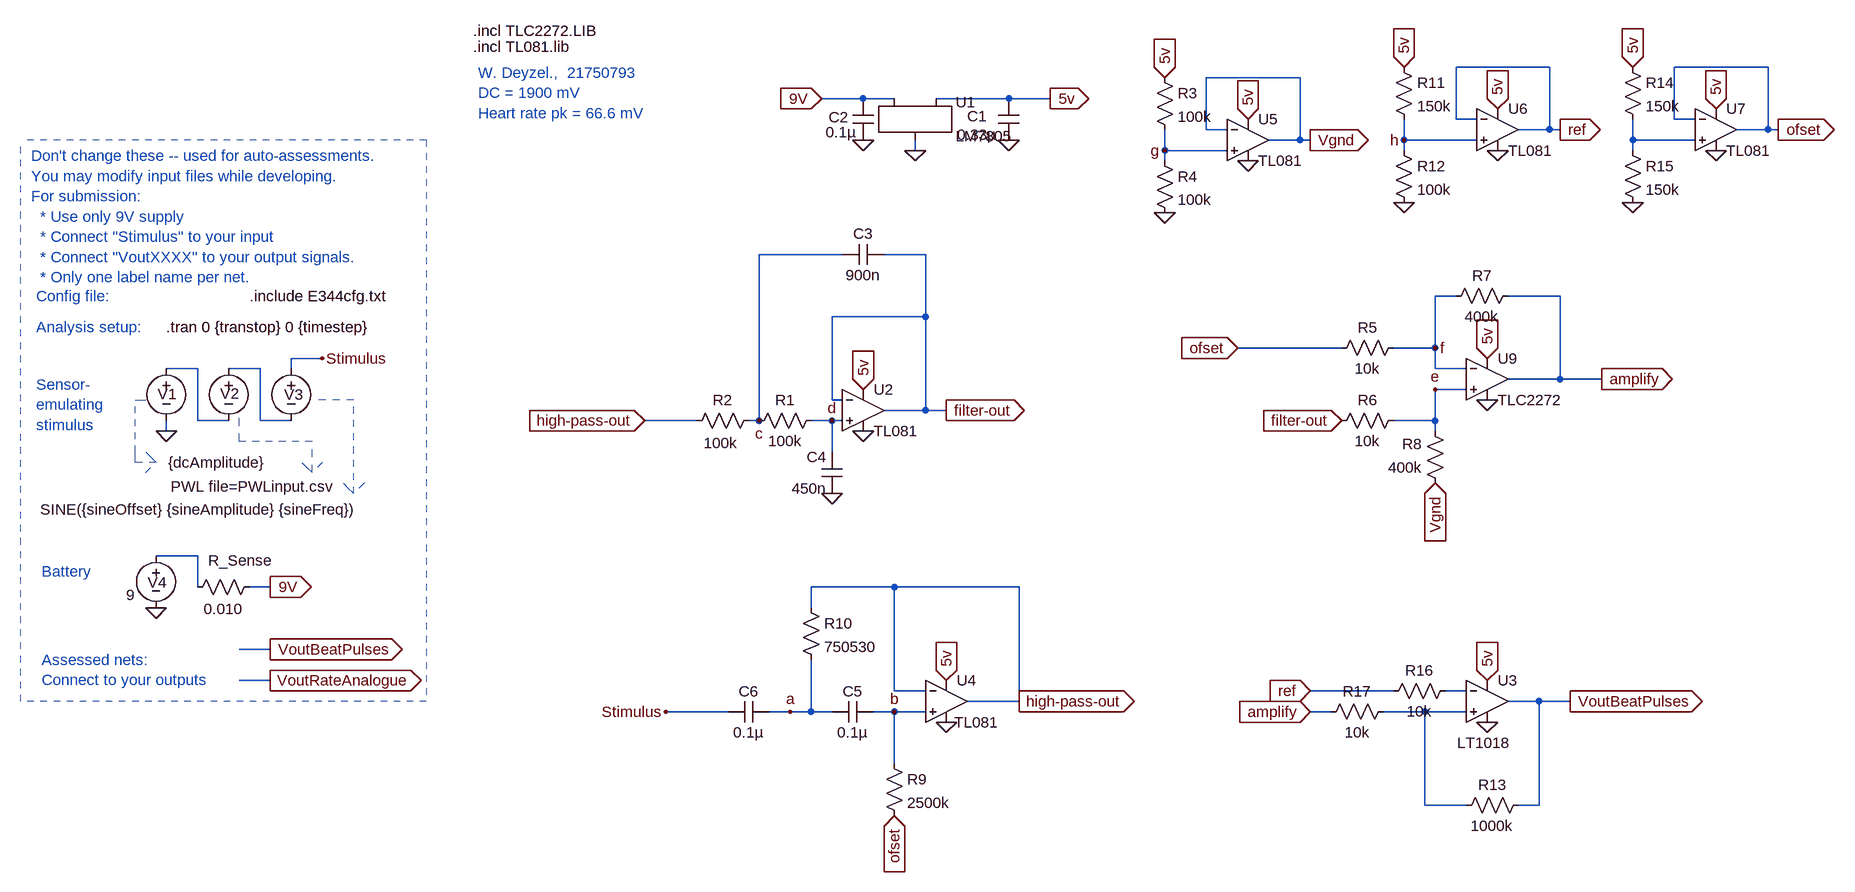
[diagram p0: schematic www.asc]
www.asc, the LTspice schematic file:
Version 4
SHEET 1 1824 680
WIRE 48 -1520 -96 -1520
WIRE 384 -1520 240 -1520
WIRE -336 -1504 -480 -1504
WIRE -1008 -1472 -1072 -1472
WIRE -960 -1472 -1008 -1472
WIRE -784 -1472 -896 -1472
WIRE -720 -1472 -784 -1472
WIRE -96 -1440 -96 -1520
WIRE -64 -1440 -96 -1440
WIRE 240 -1440 240 -1520
WIRE 272 -1440 240 -1440
WIRE -480 -1424 -480 -1504
WIRE -448 -1424 -480 -1424
WIRE 48 -1424 48 -1520
WIRE 48 -1424 0 -1424
WIRE 64 -1424 48 -1424
WIRE 384 -1424 384 -1520
WIRE 384 -1424 336 -1424
WIRE 400 -1424 384 -1424
WIRE -336 -1408 -336 -1504
WIRE -336 -1408 -384 -1408
WIRE -320 -1408 -336 -1408
WIRE -176 -1408 -176 -1440
WIRE -64 -1408 -176 -1408
WIRE 176 -1408 176 -1440
WIRE 272 -1408 176 -1408
WIRE -928 -1392 -928 -1408
WIRE -544 -1392 -544 -1424
WIRE -448 -1392 -544 -1392
WIRE -176 -1392 -176 -1408
WIRE 176 -1392 176 -1408
WIRE -544 -1376 -544 -1392
WIRE -1040 -1232 -1168 -1232
WIRE -912 -1232 -976 -1232
WIRE -96 -1168 -128 -1168
WIRE 64 -1168 -16 -1168
WIRE -912 -1136 -912 -1232
WIRE -912 -1136 -1056 -1136
WIRE -272 -1088 -432 -1088
WIRE -128 -1088 -128 -1168
WIRE -128 -1088 -192 -1088
WIRE -1840 -1072 -1888 -1072
WIRE -2032 -1056 -2080 -1056
WIRE -1936 -1056 -1984 -1056
WIRE -1888 -1056 -1888 -1072
WIRE -128 -1056 -128 -1088
WIRE -80 -1056 -128 -1056
WIRE 64 -1040 64 -1168
WIRE 64 -1040 -16 -1040
WIRE 128 -1040 64 -1040
WIRE -80 -1024 -128 -1024
WIRE -1056 -1008 -1056 -1136
WIRE -1040 -1008 -1056 -1008
WIRE -912 -992 -912 -1136
WIRE -912 -992 -976 -992
WIRE -880 -992 -912 -992
WIRE -2032 -976 -2032 -1056
WIRE -1984 -976 -2032 -976
WIRE -1936 -976 -1936 -1056
WIRE -1888 -976 -1936 -976
WIRE -1264 -976 -1344 -976
WIRE -1168 -976 -1168 -1232
WIRE -1168 -976 -1184 -976
WIRE -1056 -976 -1088 -976
WIRE -1040 -976 -1056 -976
WIRE -128 -976 -128 -1024
WIRE -128 -976 -192 -976
WIRE -2080 -960 -2080 -976
WIRE -128 -960 -128 -976
WIRE -1056 -928 -1056 -976
WIRE -2032 -768 -2096 -768
WIRE -2032 -720 -2032 -768
WIRE -1920 -720 -1952 -720
WIRE -960 -720 -1088 -720
WIRE -768 -720 -960 -720
WIRE -1088 -688 -1088 -720
WIRE -1920 -624 -1968 -624
WIRE -1920 -576 -1968 -576
WIRE -960 -560 -960 -720
WIRE -912 -560 -960 -560
WIRE -192 -560 -320 -560
WIRE -80 -560 -112 -560
WIRE -768 -544 -768 -720
WIRE -768 -544 -848 -544
WIRE 32 -544 -16 -544
WIRE 80 -544 32 -544
WIRE -1216 -528 -1312 -528
WIRE -1120 -528 -1152 -528
WIRE -1088 -528 -1088 -608
WIRE -1088 -528 -1120 -528
WIRE -1056 -528 -1088 -528
WIRE -960 -528 -992 -528
WIRE -912 -528 -960 -528
WIRE -288 -528 -320 -528
WIRE -144 -528 -208 -528
WIRE -80 -528 -144 -528
WIRE -960 -448 -960 -528
WIRE -144 -384 -144 -528
WIRE -80 -384 -144 -384
WIRE 32 -384 32 -544
WIRE 32 -384 0 -384
FLAG -2080 -960 0
FLAG -1840 -1072 Stimulus
FLAG -1920 -720 9V
IOPIN -1920 -720 Out
FLAG -2096 -688 0
FLAG -1920 -624 VoutBeatPulses
IOPIN -1920 -624 Out
FLAG -1920 -576 VoutRateAnalogue
IOPIN -1920 -576 Out
FLAG -1312 -528 Stimulus
FLAG -928 -1392 0
FLAG -1072 -1472 9V
IOPIN -1072 -1472 In
FLAG -1008 -1408 0
FLAG -784 -1408 0
FLAG -720 -1472 5v
IOPIN -720 -1472 Out
FLAG -1008 -960 0
FLAG -1008 -1024 5v
IOPIN -1008 -1024 In
FLAG -1056 -864 0
FLAG -544 -1504 5v
IOPIN -544 -1504 In
FLAG -544 -1296 0
FLAG -320 -1408 Vgnd
IOPIN -320 -1408 Out
FLAG -272 -976 filter-out
IOPIN -272 -976 In
FLAG -48 -1008 0
FLAG -48 -1072 5v
IOPIN -48 -1072 In
FLAG -128 -880 Vgnd
IOPIN -128 -880 In
FLAG -880 -992 filter-out
IOPIN -880 -992 Out
FLAG -880 -576 5v
IOPIN -880 -576 In
FLAG -880 -512 0
FLAG -768 -544 high-pass-out
IOPIN -768 -544 Out
FLAG -1344 -976 high-pass-out
IOPIN -1344 -976 In
FLAG -960 -368 ofset
IOPIN -960 -368 In
FLAG -432 -1088 ofset
IOPIN -432 -1088 In
FLAG 128 -1040 amplify
IOPIN 128 -1040 Out
FLAG -416 -1376 0
FLAG -416 -1440 5v
IOPIN -416 -1440 In
FLAG -176 -1520 5v
IOPIN -176 -1520 In
FLAG -176 -1312 0
FLAG 64 -1424 ref
IOPIN 64 -1424 Out
FLAG -32 -1392 0
FLAG -32 -1456 5v
IOPIN -32 -1456 In
FLAG -1120 -528 a
FLAG -960 -528 b
FLAG -1168 -976 c
FLAG -1056 -976 d
FLAG -128 -1024 e
FLAG -128 -1088 f
FLAG -544 -1392 g
FLAG -176 -1408 h
FLAG 176 -1520 5v
IOPIN 176 -1520 In
FLAG 176 -1312 0
FLAG 400 -1424 ofset
IOPIN 400 -1424 Out
FLAG 304 -1392 0
FLAG 304 -1456 5v
IOPIN 304 -1456 In
FLAG 80 -544 VoutBeatPulses
IOPIN 80 -544 Out
FLAG -48 -512 0
FLAG -48 -576 5v
IOPIN -48 -576 In
FLAG -320 -528 amplify
IOPIN -320 -528 In
FLAG -320 -560 ref
IOPIN -320 -560 In
SYMBOL voltage -1984 -1072 R0
WINDOW 123 0 0 Left 0
WINDOW 39 0 0 Left 0
WINDOW 3 -89 197 Left 2
WINDOW 0 -13 54 Left 2
SYMATTR Value PWL file=PWLinput.csv
SYMATTR InstName V2
SYMBOL voltage -1888 -1072 R0
WINDOW 123 24 44 Left 2
WINDOW 39 0 0 Left 0
WINDOW 3 -386 233 Left 2
WINDOW 0 -11 56 Left 2
SYMATTR Value SINE({sineOffset} {sineAmplitude} {sineFreq})
SYMATTR InstName V3
SYMBOL voltage -2080 -1072 R0
WINDOW 123 0 0 Left 0
WINDOW 39 0 0 Left 0
WINDOW 3 3 160 Left 2
WINDOW 0 -13 55 Left 2
SYMATTR Value {dcAmplitude}
SYMATTR InstName V1
SYMBOL voltage -2096 -784 R0
WINDOW 123 24 44 Left 2
WINDOW 39 0 0 Left 0
WINDOW 3 -46 76 Left 2
WINDOW 0 -13 57 Left 2
SYMATTR Value 9
SYMATTR InstName V4
SYMBOL res -1936 -736 R90
WINDOW 0 -9 30 VBottom 2
WINDOW 3 34 56 VTop 2
SYMATTR InstName R_Sense
SYMATTR Value 0.010
SYMBOL LM7805 -928 -1456 R0
SYMATTR InstName U1
SYMBOL cap -800 -1472 R0
WINDOW 3 -63 56 Left 2
WINDOW 0 -48 27 Left 2
SYMATTR Value 0.33µ
SYMATTR InstName C1
SYMBOL cap -1024 -1472 R0
WINDOW 0 -37 29 Left 2
WINDOW 3 -42 52 Left 2
SYMATTR InstName C2
SYMATTR Value 0.1µ
SYMBOL res -1072 -992 R90
WINDOW 0 0 56 VBottom 2
WINDOW 3 32 56 VTop 2
SYMATTR InstName R1
SYMATTR Value 100k
SYMBOL res -1168 -992 R90
WINDOW 0 0 56 VBottom 2
WINDOW 3 35 59 VTop 2
SYMATTR InstName R2
SYMATTR Value 100k
SYMBOL cap -976 -1248 R90
WINDOW 0 0 32 VBottom 2
WINDOW 3 32 32 VTop 2
SYMATTR InstName C3
SYMATTR Value 900n
SYMBOL cap -1040 -864 R180
WINDOW 0 24 56 Left 2
WINDOW 3 24 8 Left 2
SYMATTR InstName C4
SYMATTR Value 450n
SYMBOL Opamps\\opamp2 -1008 -1056 R0
SYMATTR InstName U2
SYMATTR Value TL081
SYMBOL res -560 -1520 R0
SYMATTR InstName R3
SYMATTR Value 100k
SYMBOL res -560 -1392 R0
SYMATTR InstName R4
SYMATTR Value 100k
SYMBOL res -176 -1104 R90
WINDOW 0 0 56 VBottom 2
WINDOW 3 32 56 VTop 2
SYMATTR InstName R5
SYMATTR Value 10k
SYMBOL res -176 -992 R90
WINDOW 0 0 56 VBottom 2
WINDOW 3 32 56 VTop 2
SYMATTR InstName R6
SYMATTR Value 10k
SYMBOL res 0 -1184 R90
WINDOW 0 0 56 VBottom 2
WINDOW 3 32 56 VTop 2
SYMATTR InstName R7
SYMATTR Value 400k
SYMBOL res -112 -864 R180
WINDOW 0 36 76 Left 2
WINDOW 3 36 40 Left 2
SYMATTR InstName R8
SYMATTR Value 400k
SYMBOL Opamps\\opamp2 -880 -608 R0
WINDOW 3 12 96 Left 2
SYMATTR Value TL081
SYMATTR InstName U4
SYMBOL res -976 -464 R0
SYMATTR InstName R9
SYMATTR Value 2500k
SYMBOL res -1104 -704 R0
SYMATTR InstName R10
SYMATTR Value 750530
SYMBOL cap -992 -544 R90
WINDOW 0 0 32 VBottom 2
WINDOW 3 32 32 VTop 2
SYMATTR InstName C5
SYMATTR Value 0.1µ
SYMBOL cap -1152 -544 R90
WINDOW 0 0 32 VBottom 2
WINDOW 3 32 32 VTop 2
SYMATTR InstName C6
SYMATTR Value 0.1µ
SYMBOL res -192 -1536 R0
SYMATTR InstName R11
SYMATTR Value 150k
SYMBOL res -192 -1408 R0
SYMATTR InstName R12
SYMATTR Value 100k
SYMBOL Opamps\\opamp2 -416 -1472 R0
SYMATTR InstName U5
SYMATTR Value TL081
SYMBOL Opamps\\opamp2 -32 -1488 R0
SYMATTR InstName U6
SYMATTR Value TL081
SYMBOL res 160 -1536 R0
SYMATTR InstName R14
SYMATTR Value 150k
SYMBOL res 160 -1408 R0
SYMATTR InstName R15
SYMATTR Value 150k
SYMBOL Opamps\\opamp2 304 -1488 R0
SYMATTR InstName U7
SYMATTR Value TL081
SYMBOL res -96 -576 R90
WINDOW 0 0 56 VBottom 2
WINDOW 3 32 56 VTop 2
SYMATTR InstName R16
SYMATTR Value 10k
SYMBOL res -192 -544 R90
WINDOW 0 0 56 VBottom 2
WINDOW 3 32 56 VTop 2
SYMATTR InstName R17
SYMATTR Value 10k
SYMBOL res 16 -400 R90
WINDOW 0 0 56 VBottom 2
WINDOW 3 32 56 VTop 2
SYMATTR InstName R13
SYMATTR Value 1000k
SYMBOL Comparators\\LT1018 -48 -544 R0
WINDOW 3 -46 64 Left 2
SYMATTR InstName U3
SYMBOL Opamps\\opamp2 -48 -1104 R0
SYMATTR InstName U9
SYMATTR Value TLC2272
TEXT -2080 -1120 Left 2 !.tran 0 {transtop} 0 {timestep}
TEXT -1952 -1168 Left 2 !.include E344cfg.txt
TEXT -2288 -1384 Left 2 ;Don't change these -- used for auto-assessments.\nYou may modify input files while developing.\nFor submission: \n  * Use only 9V supply \n  * Connect "Stimulus" to your input\n  * Connect "VoutXXXX" to your output signals.\n  * Only one label name per net.
TEXT -2280 -1168 Left 2 ;Config file:
TEXT -2280 -1120 Left 2 ;Analysis setup:
TEXT -2272 -744 Left 2 ;Battery
TEXT -2280 -1032 Left 2 ;Sensor-\nemulating \nstimulus
TEXT -2272 -608 Left 2 ;Assessed nets:\nConnect to your outputs
TEXT -1600 -1512 Left 2 ;W. Deyzel.,  21750793\nDC = 1900 mV\nHeart rate pk = 66.6 mV
TEXT -1608 -1576 Left 2 !.incl TLC2272.LIB
TEXT -1608 -1552 Left 2 !.incl TL081.lib
LINE Normal -1792 -1008 -1856 -1008 2
LINE Normal -1792 -864 -1792 -1008 2
LINE Normal -1808 -880 -1792 -864 2
LINE Normal -1792 -864 -1808 -880 2
LINE Normal -1776 -880 -1792 -864 2
LINE Normal -2128 -1008 -2112 -1008 2
LINE Normal -2128 -928 -2128 -1008 2
LINE Normal -2128 -912 -2128 -928 2
LINE Normal -2096 -912 -2128 -912 2
LINE Normal -2112 -928 -2096 -912 2
LINE Normal -2096 -912 -2112 -928 2
LINE Normal -2112 -896 -2096 -912 2
LINE Normal -1968 -944 -1968 -992 2
LINE Normal -1856 -944 -1968 -944 2
LINE Normal -1856 -896 -1856 -944 2
LINE Normal -1872 -912 -1856 -896 2
LINE Normal -1856 -896 -1872 -912 2
LINE Normal -1840 -912 -1856 -896 2
LINE Normal -2304 -544 -2304 -1408 1
LINE Normal -1680 -1408 -1680 -544 1
LINE Normal -1680 -544 -2304 -544 1
LINE Normal -1680 -1408 -2304 -1408 1

The netlist it stands for:
* www.asc
V2 N003 N002 PWL file=PWLinput.csv
V3 Stimulus N003 SINE({sineOffset} {sineAmplitude} {sineFreq})
V1 N002 0 {dcAmplitude}
V4 N004 0 9
R_Sense 9V N004 0.010
XU1 9V 0 5v LM7805
C1 5v 0 0.33µ
C2 9V 0 0.1µ
R1 d c 100k
R2 c high-pass-out 100k
C3 filter-out c 900n
C4 0 d 450n
XU2 d filter-out 5v 0 filter-out TL081  ; pins In+ In- V+ V- OUT
R3 5v g 100k
R4 g 0 100k
R5 f ofset 10k
R6 e filter-out 10k
R7 amplify f 400k
R8 Vgnd e 400k
XU4 b high-pass-out 5v 0 high-pass-out TL081  ; pins In+ In- V+ V- OUT
R9 b ofset 2500k
R10 high-pass-out a 750530
C5 b a 0.1µ
C6 a Stimulus 0.1µ
R11 5v h 150k
R12 h 0 100k
XU5 g Vgnd 5v 0 Vgnd TL081  ; pins In+ In- V+ V- OUT
XU6 h ref 5v 0 ref TL081  ; pins In+ In- V+ V- OUT
R14 5v N001 150k
R15 N001 0 150k
XU7 N001 ofset 5v 0 ofset TL081  ; pins In+ In- V+ V- OUT
R16 N005 ref 10k
R17 N006 amplify 10k
R13 VoutBeatPulses N006 1000k
XU3 N006 N005 5v 0 VoutBeatPulses LT1018  ; pins In+ In- V+ V- OUT
XU9 e f 5v 0 amplify TLC2272  ; pins In+ In- V+ V- OUT
.tran 0 {transtop} 0 {timestep}
.include E344cfg.txt
* Don't change these -- used for auto-assessments.
* You may modify input files while developing.
* For submission:
*   * Use only 9V supply
*   * Connect "Stimulus" to your input
*   * Connect "VoutXXXX" to your output signals.
*   * Only one label name per net.
* Config file:
* Analysis setup:
* Battery
* Sensor-
* emulating
* stimulus
* Assessed nets:
* Connect to your outputs
* W. Deyzel.,  21750793
* DC = 1900 mV
* Heart rate pk = 66.6 mV
.incl TLC2272.LIB
.incl TL081.lib
.lib LTC1.lib
.backanno
.end